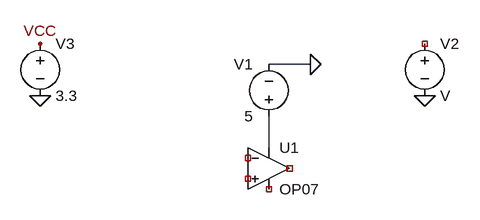
[diagram p0: schematic Themistor suplementary circut.asc]
Themistor suplementary circut.asc, the LTspice schematic file:
Version 4
SHEET 1 880 680
WIRE 384 -32 320 -32
WIRE 320 96 320 48
FLAG -32 -64 VCC
FLAG 384 -32 0
FLAG -32 16 0
FLAG 560 16 0
SYMBOL Opamps\\OP07 320 64 R0
SYMATTR InstName U1
SYMBOL voltage 320 64 R180
WINDOW 0 24 96 Left 2
WINDOW 3 24 16 Left 2
SYMATTR InstName V1
SYMATTR Value 5
SYMBOL voltage 560 -80 R0
SYMATTR InstName V2
SYMBOL voltage -32 -80 R0
SYMATTR InstName V3
SYMATTR Value 3.3

The netlist it stands for:
* Themistor suplementary circut.asc
XU1 NC_01 NC_02 N001 NC_03 NC_04 LT1001  ; OP07, pins In+ In- V+ V- OUT
V1 N001 0 5
V2 NC_05 0 V
V3 VCC 0 3.3
.lib LTC.lib
.backanno
.end